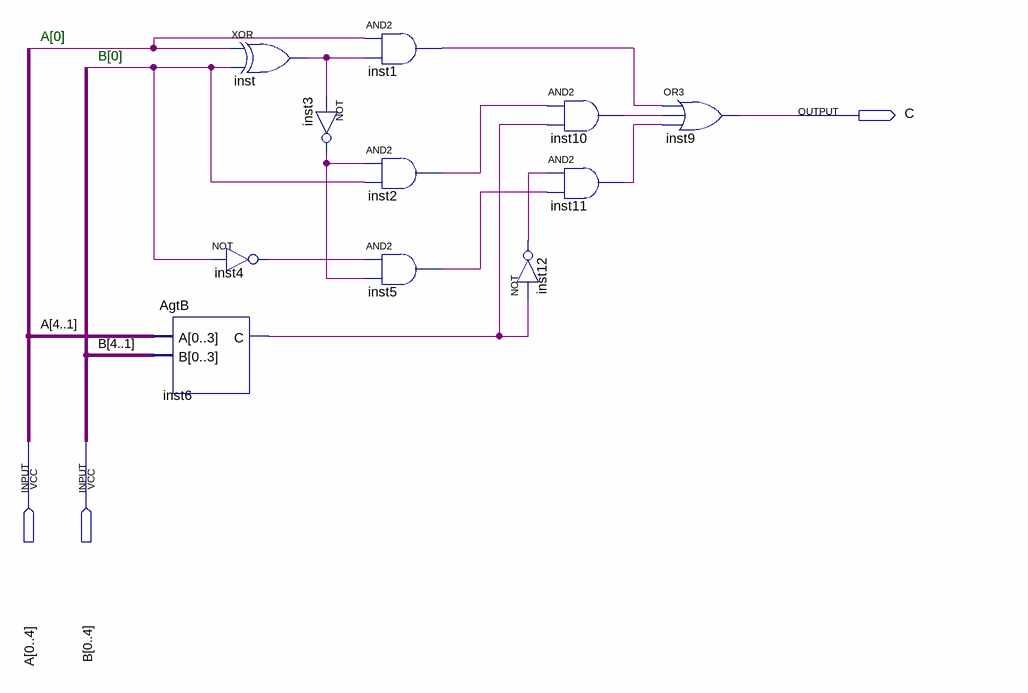
[diagram p0: schematic sheet]
// Quartus schematic menor.bdf as structural Verilog: 11 symbols, 3 pins
module menor (
  input  [0:4] A,
  input  [0:4] B,
  output C
);

  wire inst1_out, inst2_out, inst3_out, inst4_out, inst5_out, inst6_c, inst10_out, inst11_out, inst12_out,
       inst_out;

  AgtB inst6 (.A({A[4], A[3], A[2], A[1]}), .B({B[4], B[3], B[2], B[1]}), .C(inst6_c));
  xor inst (inst_out, A[0], B[0]);
  not inst4 (inst4_out, B[0]);
  not inst3 (inst3_out, inst_out);
  and inst1 (inst1_out, A[0], inst_out);
  and inst2 (inst2_out, inst3_out, B[0]);
  and inst5 (inst5_out, inst4_out, inst3_out);
  and inst10 (inst10_out, inst2_out, inst6_c);
  and inst11 (inst11_out, inst12_out, inst5_out);
  not inst12 (inst12_out, inst6_c);
  or inst9 (C, inst1_out, inst10_out, inst11_out);

  // Notes on the sheet:
  //   A[0]
  //   B[0]
endmodule
